# EAGLE design ArduSatPrototypingModule (EAGLE 6.3)
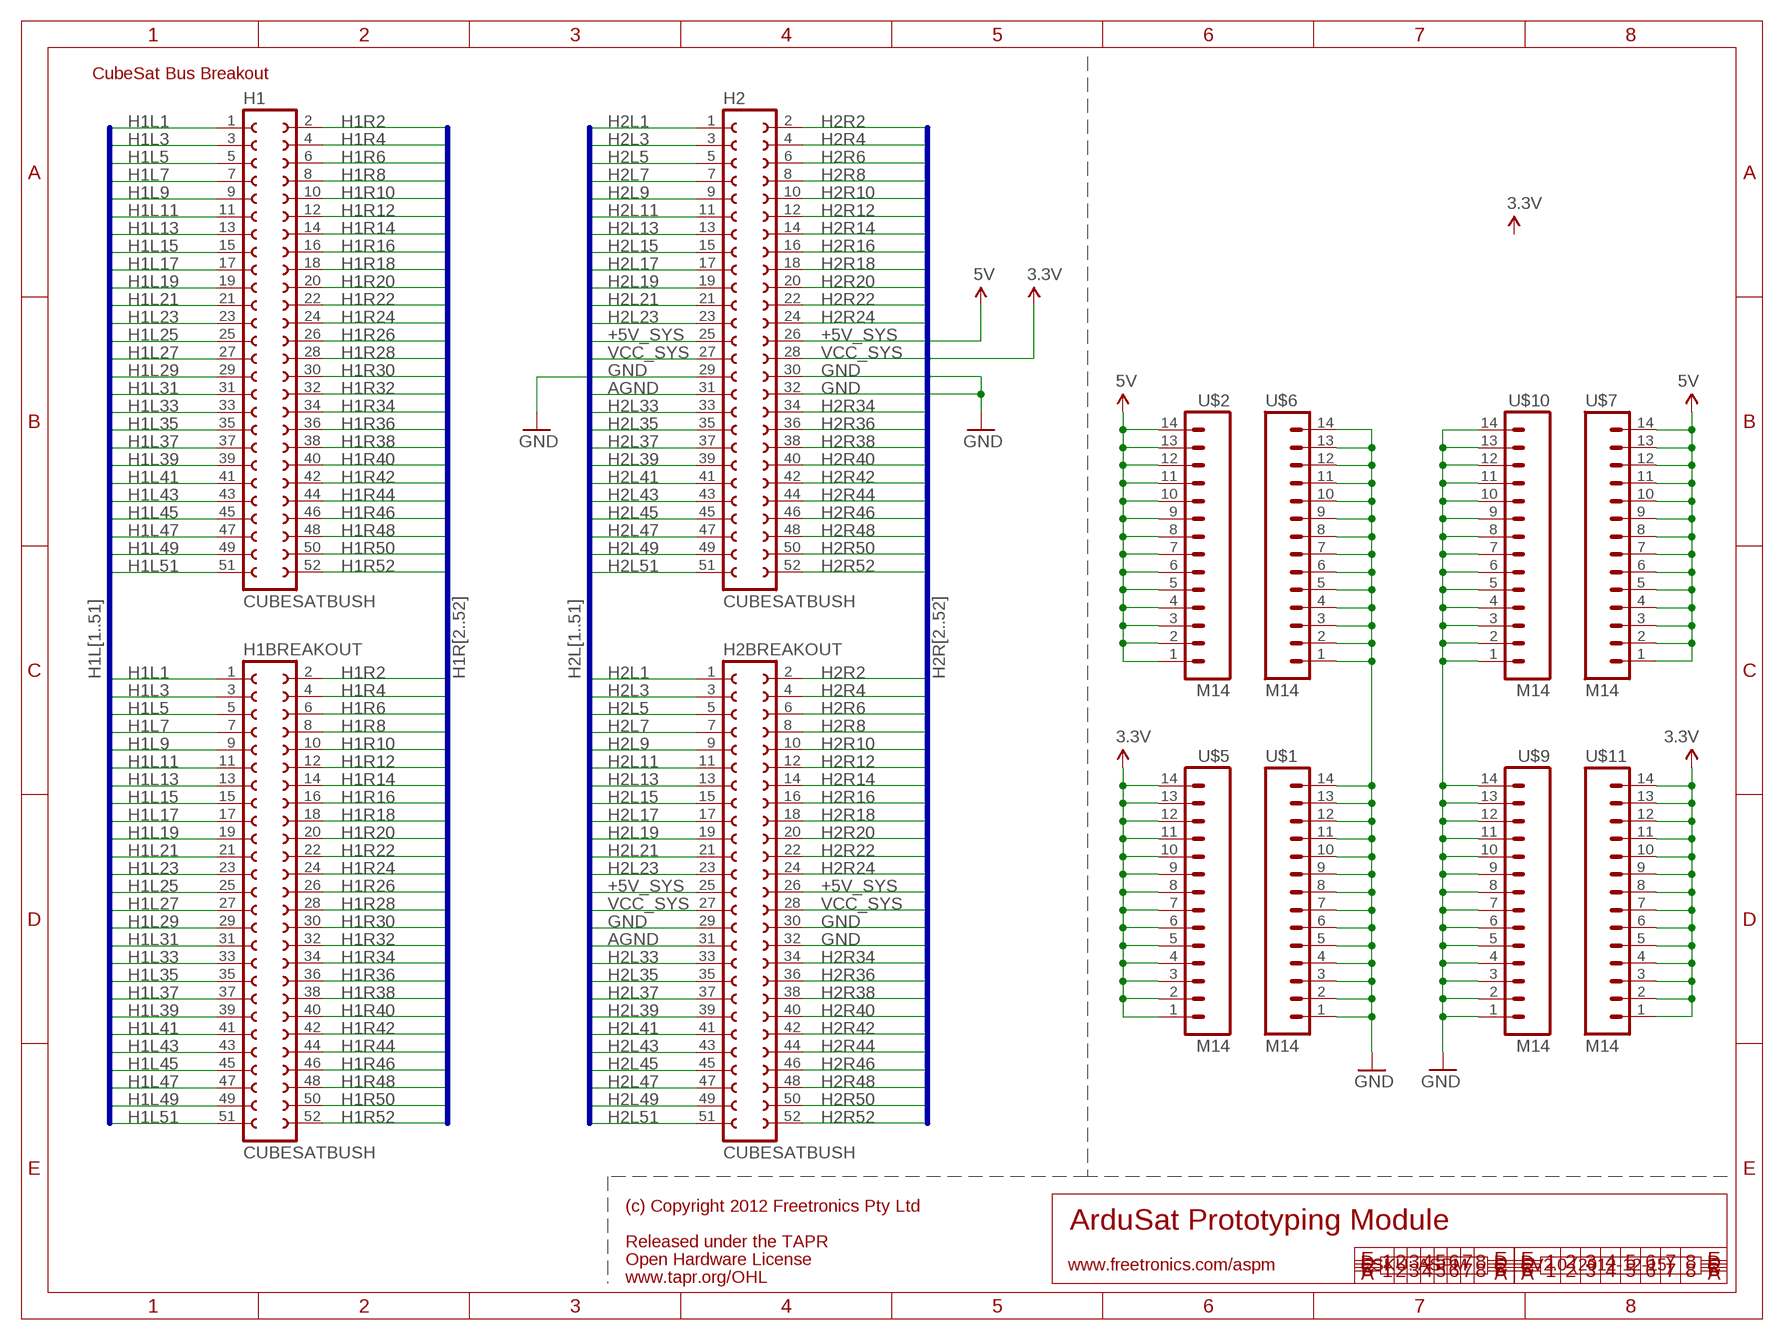
[diagram p0: schematic, sheet 1]

## Parts
H1  CUBESATBUSH  [CUBESATBUS]
H1BREAKOUT  CUBESATBUSH  [CUBESATBUS]
H2  CUBESATBUSH  [CUBESATBUS]
H2BREAKOUT  CUBESATBUSH  [CUBESATBUS]
U$1  M14  [1X14]
U$2  M14  [1X14]
U$5  M14  [1X14]
U$6  M14  [1X14]
U$7  M14  [1X14]
U$9  M14  [1X14]
U$10  M14  [1X14]
U$11  M14  [1X14]

## Nets
+5V_SYS: H2.25 H2.26 H2BREAKOUT.25 H2BREAKOUT.26 U$2.1 U$2.2 U$2.3 U$2.4 U$2.5 U$2.6 U$2.7 U$2.8 U$2.9 U$2.10 U$2.11 U$2.12 U$2.13 U$2.14 U$7.1 U$7.2 U$7.3 U$7.4 U$7.5 U$7.6 U$7.7 U$7.8 U$7.9 U$7.10 U$7.11 U$7.12 U$7.13 U$7.14 ; supply symbol labelled 5V
AGND: H2.31 H2BREAKOUT.31
GND: H2.29 H2.30 H2.32 H2BREAKOUT.29 H2BREAKOUT.30 H2BREAKOUT.32 U$1.1 U$1.2 U$1.3 U$1.4 U$1.5 U$1.6 U$1.7 U$1.8 U$1.9 U$1.10 U$1.11 U$1.12 U$1.13 U$1.14 U$6.1 U$6.2 U$6.3 U$6.4 U$6.5 U$6.6 U$6.7 U$6.8 U$6.9 U$6.10 U$6.11 U$6.12 U$6.13 U$6.14 U$9.1 U$9.2 U$9.3 U$9.4 U$9.5 U$9.6 U$9.7 U$9.8 U$9.9 U$9.10 U$9.11 U$9.12 U$9.13 U$9.14 U$10.1 U$10.2 U$10.3 U$10.4 U$10.5 U$10.6 U$10.7 U$10.8 U$10.9 U$10.10 U$10.11 U$10.12 U$10.13 U$10.14
H1L1: H1.1 H1BREAKOUT.1
H1L3: H1.3 H1BREAKOUT.3
H1L5: H1.5 H1BREAKOUT.5
H1L7: H1.7 H1BREAKOUT.7
H1L9: H1.9 H1BREAKOUT.9
H1L11: H1.11 H1BREAKOUT.11
H1L13: H1.13 H1BREAKOUT.13
H1L15: H1.15 H1BREAKOUT.15
H1L17: H1.17 H1BREAKOUT.17
H1L19: H1.19 H1BREAKOUT.19
H1L21: H1.21 H1BREAKOUT.21
H1L23: H1.23 H1BREAKOUT.23
H1L25: H1.25 H1BREAKOUT.25
H1L27: H1.27 H1BREAKOUT.27
H1L29: H1.29 H1BREAKOUT.29
H1L31: H1.31 H1BREAKOUT.31
H1L33: H1.33 H1BREAKOUT.33
H1L35: H1.35 H1BREAKOUT.35
H1L37: H1.37 H1BREAKOUT.37
H1L39: H1.39 H1BREAKOUT.39
H1L41: H1.41 H1BREAKOUT.41
H1L43: H1.43 H1BREAKOUT.43
H1L45: H1.45 H1BREAKOUT.45
H1L47: H1.47 H1BREAKOUT.47
H1L49: H1.49 H1BREAKOUT.49
H1L51: H1.51 H1BREAKOUT.51
H1R2: H1.2 H1BREAKOUT.2
H1R4: H1.4 H1BREAKOUT.4
H1R6: H1.6 H1BREAKOUT.6
H1R8: H1.8 H1BREAKOUT.8
H1R10: H1.10 H1BREAKOUT.10
H1R12: H1.12 H1BREAKOUT.12
H1R14: H1.14 H1BREAKOUT.14
H1R16: H1.16 H1BREAKOUT.16
H1R18: H1.18 H1BREAKOUT.18
H1R20: H1.20 H1BREAKOUT.20
H1R22: H1.22 H1BREAKOUT.22
H1R24: H1.24 H1BREAKOUT.24
H1R26: H1.26 H1BREAKOUT.26
H1R28: H1.28 H1BREAKOUT.28
H1R30: H1.30 H1BREAKOUT.30
H1R32: H1.32 H1BREAKOUT.32
H1R34: H1.34 H1BREAKOUT.34
H1R36: H1.36 H1BREAKOUT.36
H1R38: H1.38 H1BREAKOUT.38
H1R40: H1.40 H1BREAKOUT.40
H1R42: H1.42 H1BREAKOUT.42
H1R44: H1.44 H1BREAKOUT.44
H1R46: H1.46 H1BREAKOUT.46
H1R48: H1.48 H1BREAKOUT.48
H1R50: H1.50 H1BREAKOUT.50
H1R52: H1.52 H1BREAKOUT.52
H2L1: H2.1 H2BREAKOUT.1
H2L3: H2.3 H2BREAKOUT.3
H2L5: H2.5 H2BREAKOUT.5
H2L7: H2.7 H2BREAKOUT.7
H2L9: H2.9 H2BREAKOUT.9
H2L11: H2.11 H2BREAKOUT.11
H2L13: H2.13 H2BREAKOUT.13
H2L15: H2.15 H2BREAKOUT.15
H2L17: H2.17 H2BREAKOUT.17
H2L19: H2.19 H2BREAKOUT.19
H2L21: H2.21 H2BREAKOUT.21
H2L23: H2.23 H2BREAKOUT.23
H2L33: H2.33 H2BREAKOUT.33
H2L35: H2.35 H2BREAKOUT.35
H2L37: H2.37 H2BREAKOUT.37
H2L39: H2.39 H2BREAKOUT.39
H2L41: H2.41 H2BREAKOUT.41
H2L43: H2.43 H2BREAKOUT.43
H2L45: H2.45 H2BREAKOUT.45
H2L47: H2.47 H2BREAKOUT.47
H2L49: H2.49 H2BREAKOUT.49
H2L51: H2.51 H2BREAKOUT.51
H2R2: H2.2 H2BREAKOUT.2
H2R4: H2.4 H2BREAKOUT.4
H2R6: H2.6 H2BREAKOUT.6
H2R8: H2.8 H2BREAKOUT.8
H2R10: H2.10 H2BREAKOUT.10
H2R12: H2.12 H2BREAKOUT.12
H2R14: H2.14 H2BREAKOUT.14
H2R16: H2.16 H2BREAKOUT.16
H2R18: H2.18 H2BREAKOUT.18
H2R20: H2.20 H2BREAKOUT.20
H2R22: H2.22 H2BREAKOUT.22
H2R24: H2.24 H2BREAKOUT.24
H2R34: H2.34 H2BREAKOUT.34
H2R36: H2.36 H2BREAKOUT.36
H2R38: H2.38 H2BREAKOUT.38
H2R40: H2.40 H2BREAKOUT.40
H2R42: H2.42 H2BREAKOUT.42
H2R44: H2.44 H2BREAKOUT.44
H2R46: H2.46 H2BREAKOUT.46
H2R48: H2.48 H2BREAKOUT.48
H2R50: H2.50 H2BREAKOUT.50
H2R52: H2.52 H2BREAKOUT.52
VCC_SYS: H2.27 H2.28 H2BREAKOUT.27 H2BREAKOUT.28 U$5.1 U$5.2 U$5.3 U$5.4 U$5.5 U$5.6 U$5.7 U$5.8 U$5.9 U$5.10 U$5.11 U$5.12 U$5.13 U$5.14 U$11.1 U$11.2 U$11.3 U$11.4 U$11.5 U$11.6 U$11.7 U$11.8 U$11.9 U$11.10 U$11.11 U$11.12 U$11.13 U$11.14 ; supply symbol labelled 3.3V

## Buses
H1L[1..51]
H1R[2..52]
H2L[1..51]
H2R[2..52]

## Notes on the sheet
- CubeSat Bus Breakout
- (c) Copyright 2012 Freetronics Pty Ltd
- ArduSat Prototyping Module
- Released under the TAPR
- Open Hardware License
- www.freetronics.com/aspm | SKU: ASPM | V2.0 (2012-12-15)
- www.tapr.org/OHL

## Library data of the parts
H1 H1BREAKOUT H2 H2BREAKOUT = freetronics-jon:CUBESATBUS
U$1 U$2 U$5-U$7 U$9-U$11 = freetronics-original:M14: Header 14 Standard 14-pin 0.1" header. Use with straight break away headers (SKU : PRT-00116), right angle break away headers (PRT-00553), swiss pins (PRT-00743), machine pins (PRT-00117), and female headers (PRT-00115).

## Board
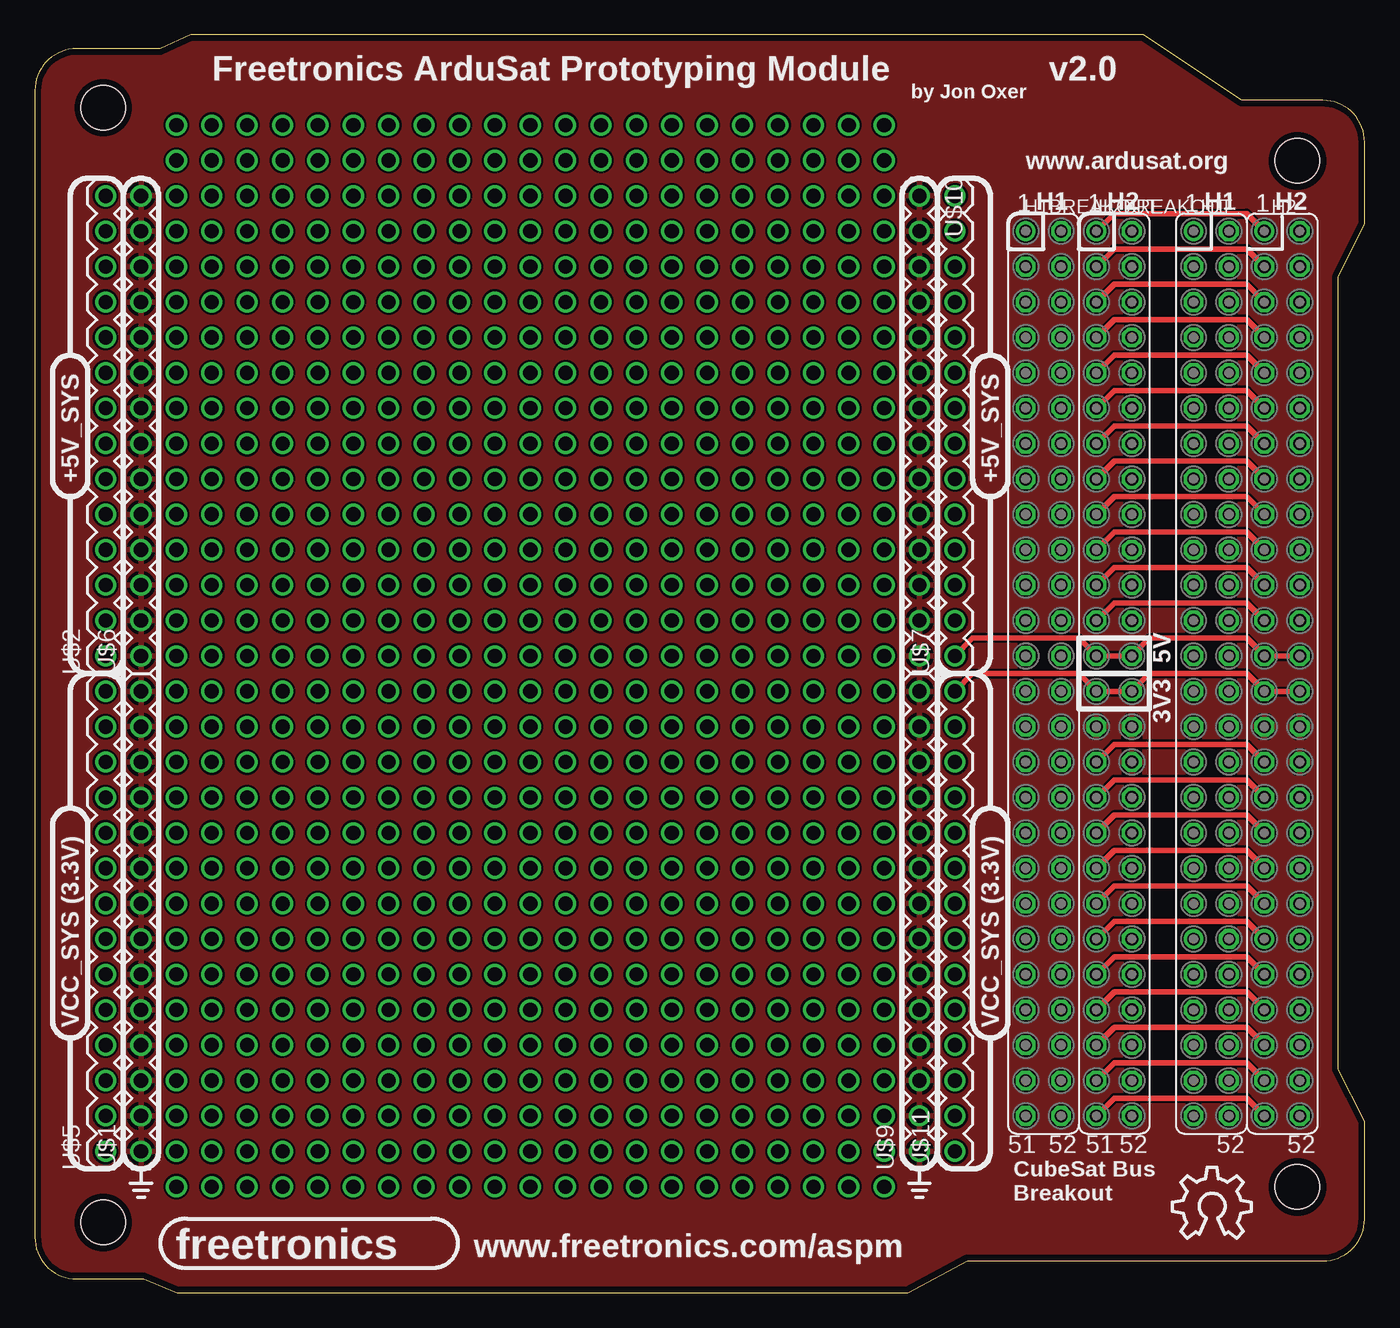
[diagram p1: board, top side]
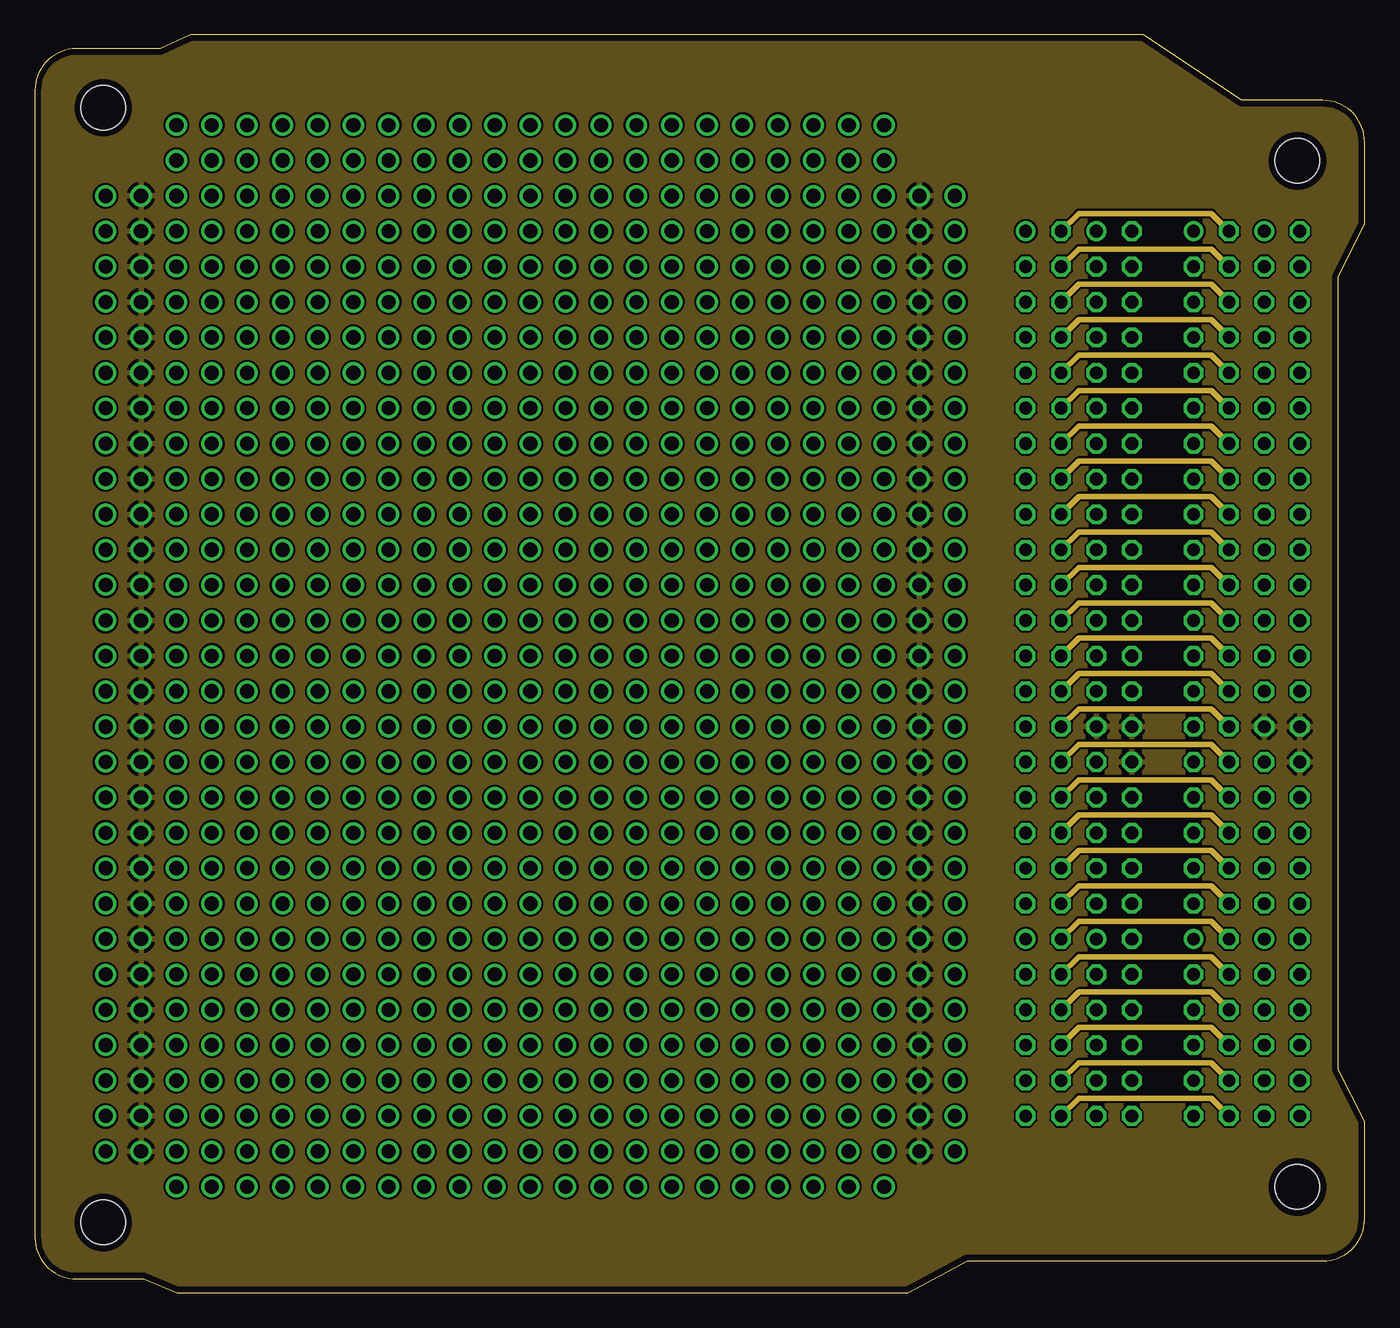
[diagram p2: board, inner layer Route2]
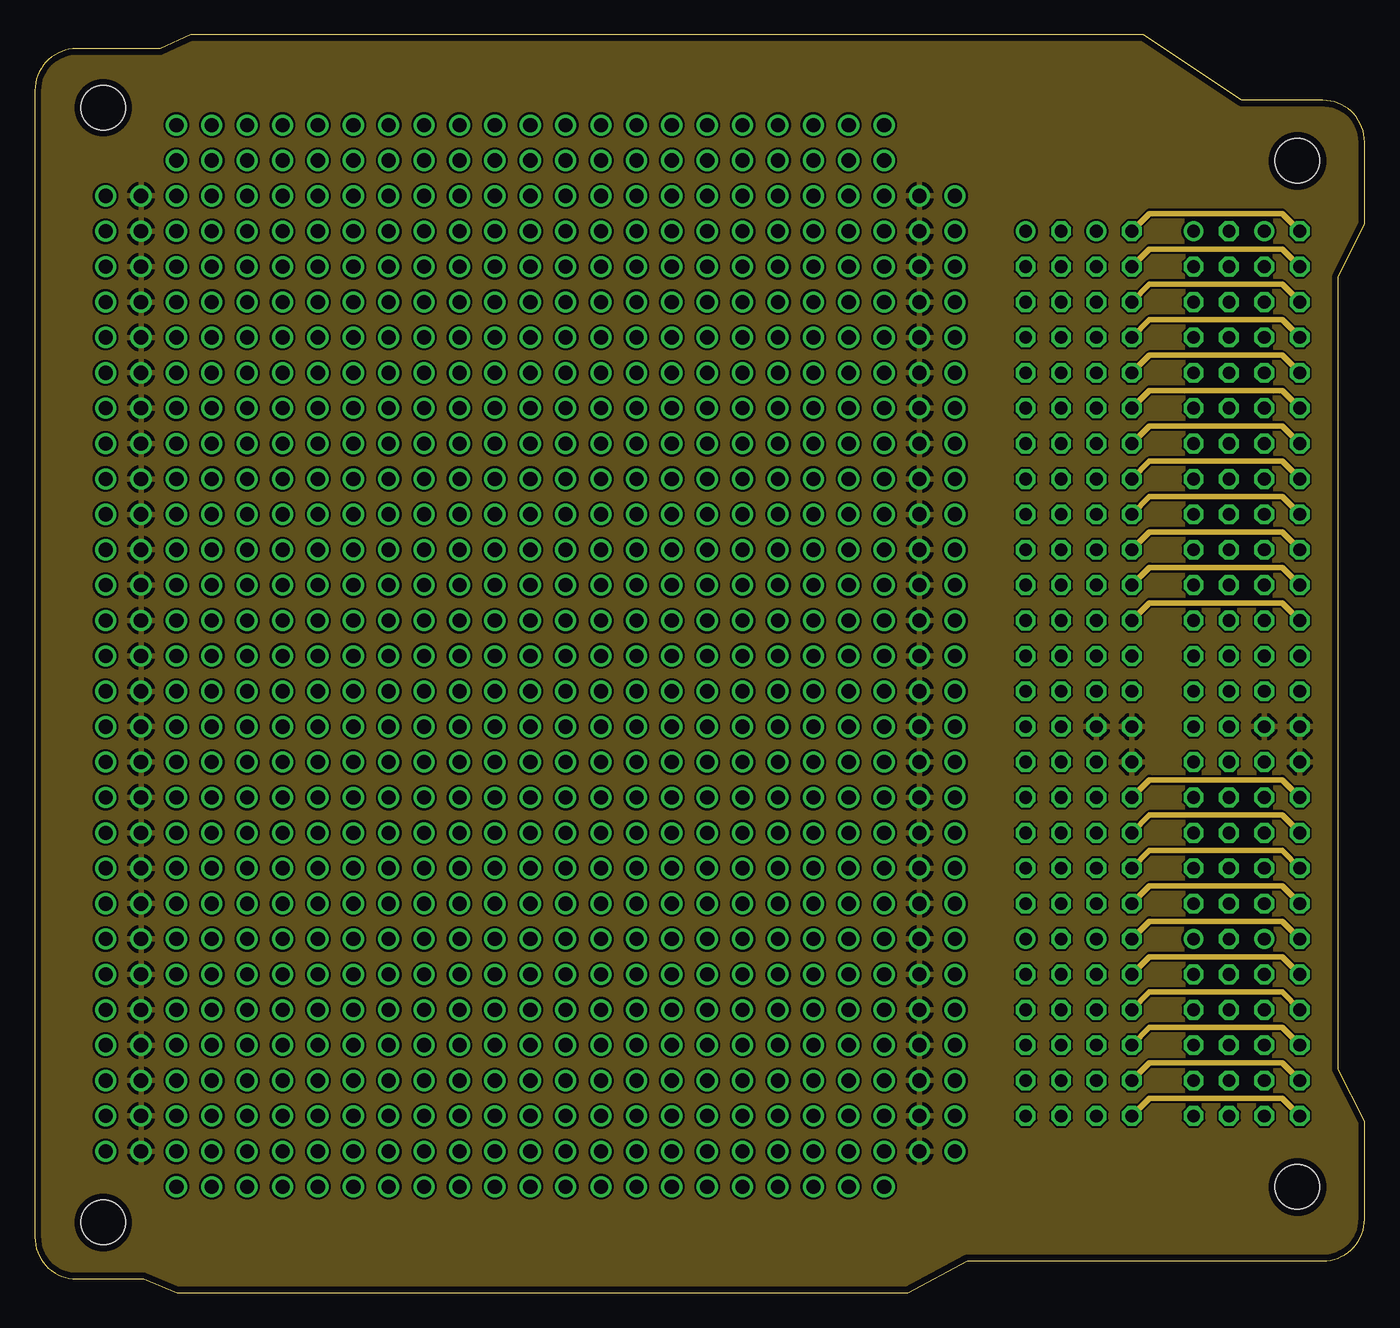
[diagram p3: board, inner layer Route15]
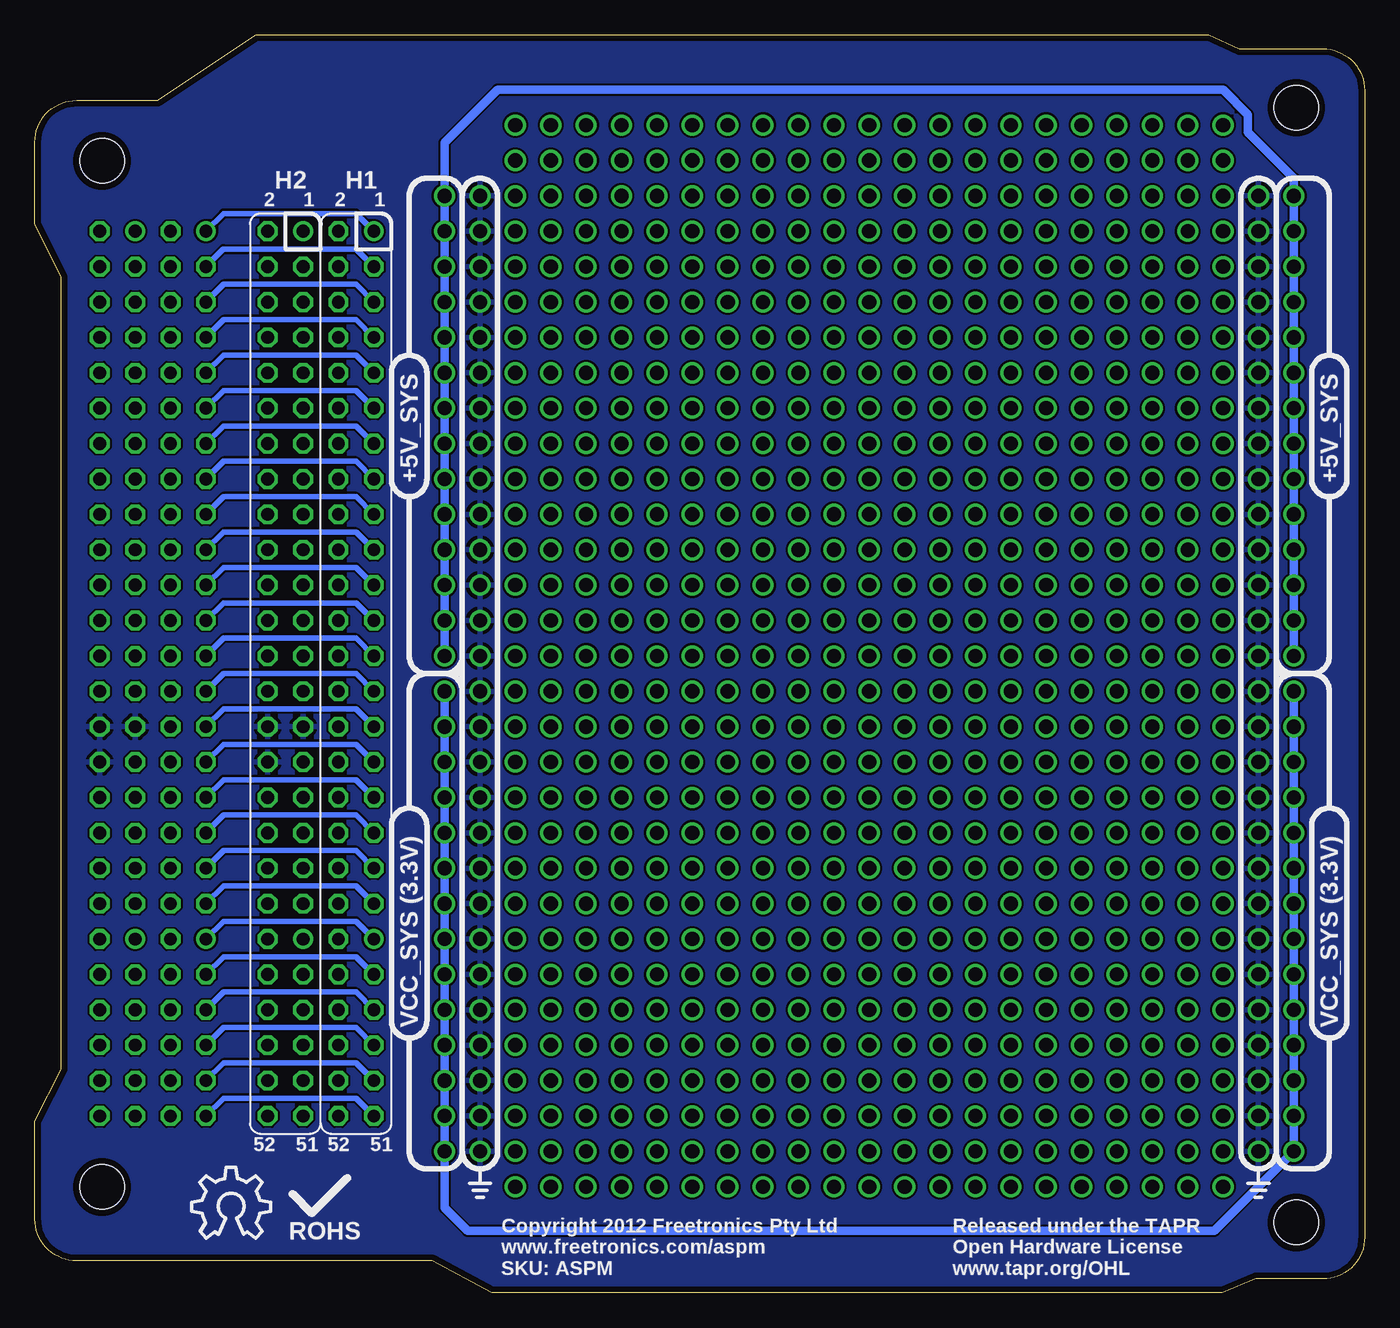
[diagram p4: board, bottom side, seen from below]

Size 95.45 x 90.3 mm. Coordinates in mm from the lower left corner, seen from the top.
Outline: 0,4 arc90 3,1 7.81,1 10.23,0 62.65,0 66.94,2.3 92.45,2.3 arc90 95.45,5.3 95.45,12.31 93.55,16.05 93.55,72.91 95.45,76.74 95.45,82.6 arc90 92.45,85.6 86.64,85.6 79.56,90.3 11.2,90.3 9,89.3 3,89.3 arc90 0,86.3 0,4
Copper layers (1+2*15+16): Top 0.035mm / dielectric 1.5mm / Route2 0.035mm / dielectric 0.15mm / Route15 0.035mm / dielectric 0.2mm / Bottom 0.035mm
Design rules "default *": minimum track width 6mil, minimum drill 24mil, track to track 6mil, track to pad 12mil, pad to pad 12mil, via to via 12mil, smd to smd 8mil, copper to edge 18mil, drill to drill 8mil, minimum pad ring 10mil, minimum via ring 8mil, stop-mask expansion 4mil, vias tented up to drill 0mil, thermal gap 10mil
Holes 3.2 mm at 4.91,5.05 4.91,85.07 90.63,81.26 90.63,7.6

### Footprints (pad centres in the part's own frame; a part is rotated, then mirrored left to right if it is on the bottom)
CUBESATBUS = drill 0.914: 1 -31.75,-1.27; 41 19.05,-1.27 | drill 0.914 octagon: 2 -31.75,1.27; 3 -29.21,-1.27; 4 -29.21,1.27; 5 -26.67,-1.27; 6 -26.67,1.27; 7 -24.13,-1.27; 8 -24.13,1.27; 9 -21.59,-1.27; 10 -21.59,1.27; 11 -19.05,-1.27; 12 -19.05,1.27; 13 -16.51,-1.27; 14 -16.51,1.27; 15 -13.97,-1.27; 16 -13.97,1.27; 17 -11.43,-1.27; 18 -11.43,1.27; 19 -8.89,-1.27; 20 -8.89,1.27; 21 -6.35,-1.27; 22 -6.35,1.27; 23 -3.81,-1.27; 24 -3.81,1.27; 25 -1.27,-1.27; 26 -1.27,1.27; 27 1.27,-1.27; 28 1.27,1.27; 29 3.81,-1.27; 30 3.81,1.27; 31 6.35,-1.27; 32 6.35,1.27; 33 8.89,-1.27; 34 8.89,1.27; 35 11.43,-1.27; 36 11.43,1.27; 37 13.97,-1.27; 38 13.97,1.27; 39 16.51,-1.27; 40 16.51,1.27; 42 19.05,1.27; 43 21.59,-1.27; 44 21.59,1.27; 45 24.13,-1.27; 46 24.13,1.27; 47 26.67,-1.27; 48 26.67,1.27; 49 29.21,-1.27; 50 29.21,1.27; 51 31.75,-1.27; 52 31.75,1.27
1X14 = drill 1.016: 1 0,0; 2 2.54,0; 3 5.08,0; 4 7.62,0; 5 10.16,0; 6 12.7,0; 7 15.24,0; 8 17.78,0; 9 20.32,0; 10 22.86,0; 11 25.4,0; 12 27.94,0; 13 30.48,0; 14 33.02,0

### Placement (x,y rotation side)
H1  84.44,44.45 270 top
H1BREAKOUT  72.39,44.45 270 top
H2  89.52,44.45 270 top
H2BREAKOUT  77.47,44.45 270 top
U$1  7.62,10.16 90 top
U$2  5.08,45.72 90 top
U$5  5.08,10.16 90 top
U$6  7.62,45.72 90 top
U$7  66.04,45.72 90 top
U$9  63.5,10.16 90 top
U$10  63.5,78.74 270 top
U$11  66.04,10.16 90 top
U$12  [OSHW_10X200_NOTEXT]  84.2,3.94 0 bottom
U$13  [OSHW_10X200_NOTEXT]  81.66,3.94 0 top

### Tracks (layer width: path | path; a pad name or v marks a point on that pad's centre or on a via)
+5V_SYS
  Top 0.406: U$7.1 67.31,46.99 74.93,46.99 H2BREAKOUT.25 H2BREAKOUT.26 80.01,46.99 87,46.99 88.25,45.73 H2.25 H2.26
  Bottom 0.254: U$7.1 66.04,75.56
  Bottom 0.61: U$2.1 U$2.2 U$2.3 U$2.4 U$2.5 U$2.6 U$2.7 U$2.8 U$2.9 U$2.10 U$2.11 U$2.12 U$2.13 U$2.14 5.08,80.01 8.38,83.31 8.38,84.58 10.16,86.36 62.23,86.36 66.04,82.55 U$7.14 U$7.13 U$7.12 U$7.11 U$7.10 U$7.9 U$7.8 U$7.7 U$7.6 U$7.5 U$7.4 U$7.3 U$7.2 U$7.1
AGND
  Top 0.406: H2.31 88.25,38.12 87,39.37 77.47,39.37 H2BREAKOUT.31
GND
  pour Bottom: 0,86.3 arc-90 3,89.3 9,89.3 11.2,90.3 79.56,90.3 86.64,85.6 92.45,85.6 arc-90 95.45,82.6 95.45,76.74 93.55,72.91 93.55,16.05 95.45,12.31 95.45,5.08 arc-90 92.45,2.3 66.94,2.3 62.65,0 10.16,0 7.81,1 3,1 arc-90 0,4
  pour Top: 0,86.3 arc-90 3,89.3 9,89.3 11.2,90.3 79.56,90.3 86.64,85.6 92.45,85.6 arc-90 95.45,82.6 95.45,76.74 93.55,72.91 93.55,16.05 95.45,12.31 95.45,5.08 arc-90 92.45,2.3 66.94,2.3 62.65,0 10.16,0 7.81,1 3,1 arc-90 0,4
  pour Route2: 0,86.3 arc-90 3,89.3 9,89.3 11.2,90.3 79.56,90.3 86.64,85.6 92.45,85.6 arc-90 95.45,82.6 95.45,76.74 93.55,72.91 93.55,16.05 95.45,12.31 95.45,5.08 arc-90 92.45,2.3 66.94,2.3 62.65,0 10.16,0 7.81,1 3,1 arc-90 0,4
  pour Route15: 0,86.3 arc-90 3,89.3 9,89.3 11.2,90.3 79.56,90.3 86.64,85.6 92.45,85.6 arc-90 95.45,82.6 95.45,76.74 93.55,72.91 93.55,16.05 95.45,12.31 95.45,5.08 arc-90 92.45,2.3 66.94,2.3 62.65,0 10.16,0 7.81,1 3,1 arc-90 0,4
H1L1
  Bottom 0.406: H1BREAKOUT.1 72.39,77.47 81.9,77.47 H1.1
H1L3
  Bottom 0.406: H1.3 83.17,73.67 81.92,74.93 72.39,74.93 H1BREAKOUT.3
H1L5
  Bottom 0.406: H1BREAKOUT.5 72.39,72.39 81.9,72.39 H1.5
H1L7
  Bottom 0.406: H1BREAKOUT.7 72.39,69.85 81.9,69.85 H1.7
H1L9
  Bottom 0.406: H1BREAKOUT.9 72.39,67.31 81.9,67.31 H1.9
H1L11
  Bottom 0.406: H1BREAKOUT.11 72.39,64.77 81.9,64.77 H1.11
H1L13
  Bottom 0.406: H1BREAKOUT.13 72.39,62.23 81.9,62.23 H1.13
H1L15
  Bottom 0.406: H1BREAKOUT.15 72.39,59.69 81.9,59.69 H1.15
H1L17
  Bottom 0.406: H1BREAKOUT.17 72.39,57.15 81.9,57.15 H1.17
H1L19
  Bottom 0.406: H1BREAKOUT.19 72.39,54.61 81.9,54.61 H1.19
H1L21
  Bottom 0.406: H1BREAKOUT.21 72.39,52.07 81.9,52.07 H1.21
H1L23
  Bottom 0.406: H1BREAKOUT.23 72.39,49.53 81.9,49.53 H1.23
H1L25
  Bottom 0.406: H1BREAKOUT.25 72.39,46.99 81.9,46.99 H1.25
H1L27
  Bottom 0.406: H1BREAKOUT.27 72.39,44.45 81.9,44.45 H1.27
H1L29
  Bottom 0.406: H1BREAKOUT.29 72.39,41.91 81.9,41.91 H1.29
H1L31
  Bottom 0.406: H1BREAKOUT.31 72.39,39.37 81.9,39.37 H1.31
H1L33
  Bottom 0.406: H1BREAKOUT.33 72.39,36.83 81.9,36.83 H1.33
H1L35
  Bottom 0.406: H1BREAKOUT.35 72.39,34.29 81.9,34.29 H1.35
H1L37
  Bottom 0.406: H1BREAKOUT.37 72.39,31.75 81.9,31.75 H1.37
H1L39
  Bottom 0.406: H1BREAKOUT.39 72.39,29.21 81.9,29.21 H1.39
H1L41
  Bottom 0.406: H1BREAKOUT.41 72.39,26.67 81.9,26.67 H1.41
H1L43
  Bottom 0.406: H1BREAKOUT.43 72.39,24.13 81.9,24.13 H1.43
H1L45
  Bottom 0.406: H1BREAKOUT.45 72.39,21.59 81.9,21.59 H1.45
H1L47
  Bottom 0.406: H1BREAKOUT.47 72.39,19.05 81.9,19.05 H1.47
H1L49
  Bottom 0.406: H1BREAKOUT.49 72.39,16.51 81.9,16.51 H1.49
H1L51
  Bottom 0.406: H1BREAKOUT.51 72.39,13.97 81.9,13.97 H1.51
H1R2
  Route2 0.406: H1.2 85.71,76.22 84.45,77.47 74.93,77.47 H1BREAKOUT.2
H1R4
  Route2 0.406: H1.4 85.71,73.67 84.45,74.93 74.93,74.93 H1BREAKOUT.4
H1R6
  Route2 0.406: H1.6 85.71,71.14 84.45,72.39 74.93,72.39 H1BREAKOUT.6
H1R8
  Route2 0.406: H1.8 85.71,68.59 84.45,69.85 74.93,69.85 H1BREAKOUT.8
H1R10
  Route2 0.406: H1BREAKOUT.10 74.93,67.31 84.44,67.31 H1.10
H1R12
  Route2 0.406: H1.12 85.71,63.52 84.45,64.77 74.93,64.77 H1BREAKOUT.12
H1R14
  Route2 0.406: H1BREAKOUT.14 74.93,62.23 84.44,62.23 H1.14
H1R16
  Route2 0.406: H1.16 85.71,58.44 84.45,59.69 74.93,59.69 H1BREAKOUT.16
H1R18
  Route2 0.406: H1.18 85.71,55.9 84.45,57.15 74.93,57.15 H1BREAKOUT.18
H1R20
  Route2 0.406: H1BREAKOUT.20 74.93,54.61 84.44,54.61 H1.20
H1R22
  Route2 0.406: H1.22 85.71,50.81 84.45,52.07 74.93,52.07 H1BREAKOUT.22
H1R24
  Route2 0.406: H1.24 85.71,48.27 84.45,49.53 74.93,49.53 H1BREAKOUT.24
H1R26
  Route2 0.406: H1.26 85.71,45.73 84.45,46.99 74.93,46.99 H1BREAKOUT.26
H1R28
  Route2 0.406: H1.28 85.71,43.2 84.45,44.45 74.93,44.45 H1BREAKOUT.28
H1R30
  Route2 0.406: H1.30 85.71,40.66 84.45,41.91 74.93,41.91 H1BREAKOUT.30
H1R32
  Route2 0.406: H1.32 85.71,38.12 84.45,39.37 74.93,39.37 H1BREAKOUT.32
H1R34
  Route2 0.406: H1.34 85.71,35.58 84.45,36.83 74.93,36.83 H1BREAKOUT.34
H1R36
  Route2 0.406: H1.36 85.71,33.03 84.45,34.29 74.93,34.29 H1BREAKOUT.36
H1R38
  Route2 0.406: H1.38 85.71,30.5 84.45,31.75 74.93,31.75 H1BREAKOUT.38
H1R40
  Route2 0.406: H1.40 85.71,27.95 84.45,29.21 74.93,29.21 H1BREAKOUT.40
H1R42
  Route2 0.406: H1.42 85.71,25.41 84.45,26.67 74.93,26.67 H1BREAKOUT.42
H1R44
  Route2 0.406: H1.44 85.71,22.88 84.45,24.13 74.93,24.13 H1BREAKOUT.44
H1R46
  Route2 0.406: H1.46 85.71,20.34 84.45,21.59 74.93,21.59 H1BREAKOUT.46
H1R48
  Route2 0.406: H1.48 85.71,17.8 84.45,19.05 74.93,19.05 H1BREAKOUT.48
H1R50
  Route2 0.406: H1.50 85.71,15.26 84.45,16.51 74.93,16.51 H1BREAKOUT.50
H1R52
  Route2 0.406: H1.52 85.71,12.71 84.45,13.97 74.93,13.97 H1BREAKOUT.52
H2L1
  Top 0.406: H2BREAKOUT.1 77.47,77.47 86.98,77.47 H2.1
H2L3
  Top 0.406: H2.3 88.25,73.67 87,74.93 77.47,74.93 H2BREAKOUT.3
H2L5
  Top 0.406: H2BREAKOUT.5 77.47,72.39 86.98,72.39 H2.5
H2L7
  Top 0.406: H2.7 88.25,68.59 87,69.85 77.47,69.85 H2BREAKOUT.7
H2L9
  Top 0.406: H2BREAKOUT.9 77.47,67.31 86.98,67.31 H2.9
H2L11
  Top 0.406: H2.11 88.25,63.52 87,64.77 77.47,64.77 H2BREAKOUT.11
H2L13
  Top 0.406: H2BREAKOUT.13 77.47,62.23 86.98,62.23 H2.13
H2L15
  Top 0.406: H2.15 88.25,58.44 87,59.69 77.47,59.69 H2BREAKOUT.15
H2L17
  Top 0.406: H2BREAKOUT.17 77.47,57.15 86.98,57.15 H2.17
H2L19
  Top 0.406: H2.19 88.25,53.35 87,54.61 77.47,54.61 H2BREAKOUT.19
H2L21
  Top 0.406: H2.21 88.25,50.81 87,52.07 77.47,52.07 H2BREAKOUT.21
H2L23
  Top 0.406: H2.23 88.25,48.27 87,49.53 77.47,49.53 H2BREAKOUT.23
H2L33
  Top 0.406: H2.33 88.25,35.58 87,36.83 77.47,36.83 H2BREAKOUT.33
H2L35
  Top 0.406: H2.35 88.25,33.03 87,34.29 77.47,34.29 H2BREAKOUT.35
H2L37
  Top 0.406: H2.37 88.25,30.5 87,31.75 77.47,31.75 H2BREAKOUT.37
H2L39
  Top 0.406: H2.39 88.25,27.95 87,29.21 77.47,29.21 H2BREAKOUT.39
H2L41
  Top 0.406: H2.41 88.25,25.41 87,26.67 77.47,26.67 H2BREAKOUT.41
H2L43
  Top 0.406: H2.43 88.25,22.88 87,24.13 77.47,24.13 H2BREAKOUT.43
H2L45
  Top 0.406: H2.45 88.25,20.34 87,21.59 77.47,21.59 H2BREAKOUT.45
H2L47
  Top 0.406: H2.47 88.25,17.8 87,19.05 77.47,19.05 H2BREAKOUT.47
H2L49
  Top 0.406: H2.49 88.25,15.26 87,16.51 77.47,16.51 H2BREAKOUT.49
H2L51
  Top 0.406: H2.51 88.25,12.71 87,13.97 77.47,13.97 H2BREAKOUT.51
H2R2
  Route15 0.406: H2.2 90.79,76.22 89.53,77.47 80.01,77.47 H2BREAKOUT.2
H2R4
  Route15 0.406: H2.4 90.79,73.67 89.53,74.93 80.01,74.93 H2BREAKOUT.4
H2R6
  Route15 0.406: H2.6 90.79,71.14 89.53,72.39 80.01,72.39 H2BREAKOUT.6
H2R8
  Route15 0.406: H2.8 90.79,68.59 89.53,69.85 80.01,69.85 H2BREAKOUT.8
H2R10
  Route15 0.406: H2.10 90.79,66.06 89.53,67.31 80.01,67.31 H2BREAKOUT.10
H2R12
  Route15 0.406: H2.12 90.79,63.52 89.53,64.77 80.01,64.77 H2BREAKOUT.12
H2R14
  Route15 0.406: H2.14 90.79,60.98 89.53,62.23 80.01,62.23 H2BREAKOUT.14
H2R16
  Route15 0.406: H2.16 90.79,58.44 89.53,59.69 80.01,59.69 H2BREAKOUT.16
H2R18
  Route15 0.406: H2.18 90.79,55.9 89.53,57.15 80.01,57.15 H2BREAKOUT.18
H2R20
  Route15 0.406: H2.20 90.79,53.35 89.53,54.61 80.01,54.61 H2BREAKOUT.20
H2R22
  Route15 0.406: H2BREAKOUT.22 80.01,52.07 89.52,52.07 H2.22
H2R24
  Route15 0.406: H2.24 90.79,48.27 89.53,49.53 80.01,49.53 H2BREAKOUT.24
H2R34
  Route15 0.406: H2BREAKOUT.34 80.01,36.83 89.52,36.83 H2.34
H2R36
  Route15 0.406: H2.36 90.79,33.03 89.53,34.29 80.01,34.29 H2BREAKOUT.36
H2R38
  Route15 0.406: H2BREAKOUT.38 80.01,31.75 89.52,31.75 H2.38
H2R40
  Route15 0.406: H2.40 90.79,27.95 89.53,29.21 80.01,29.21 H2BREAKOUT.40
H2R42
  Route15 0.406: H2BREAKOUT.42 80.01,26.67 89.52,26.67 H2.42
H2R44
  Route15 0.406: H2.44 90.79,22.88 89.53,24.13 80.01,24.13 H2BREAKOUT.44
H2R46
  Route15 0.406: H2BREAKOUT.46 80.01,21.59 89.52,21.59 H2.46
H2R48
  Route15 0.406: H2.48 90.79,17.8 89.53,19.05 80.01,19.05 H2BREAKOUT.48
H2R50
  Route15 0.406: H2BREAKOUT.50 80.01,16.51 89.52,16.51 H2.50
H2R52
  Route15 0.406: H2.52 90.79,12.71 89.53,13.97 80.01,13.97 H2BREAKOUT.52
N$2  (via drill 1.02)
  other vias: 60.96,45.72
N$3  (via drill 1.02)
  other vias: 58.42,45.72
N$4  (via drill 1.02)
  other vias: 55.88,45.72
N$5  (via drill 1.02)
  other vias: 58.42,55.88
N$7  (via drill 1.02)
  other vias: 55.88,55.88
N$8  (via drill 1.02)
  other vias: 53.34,55.88
N$9  (via drill 1.02)
  other vias: 50.8,55.88
N$10  (via drill 1.02)
  other vias: 48.26,55.88
N$11  (via drill 1.02)
  other vias: 45.72,55.88
N$12  (via drill 1.02)
  other vias: 43.18,55.88
N$13  (via drill 1.02)
  other vias: 40.64,55.88
N$14  (via drill 1.02)
  other vias: 38.1,55.88
N$15  (via drill 1.02)
  other vias: 35.56,55.88
N$16  (via drill 1.02)
  other vias: 33.02,55.88
N$17  (via drill 1.02)
  other vias: 30.48,55.88
N$18  (via drill 1.02)
  other vias: 27.94,55.88
N$19  (via drill 1.02)
  other vias: 25.4,55.88
N$20  (via drill 1.02)
  other vias: 22.86,55.88
N$21  (via drill 1.02)
  other vias: 20.32,55.88
N$22  (via drill 1.02)
  other vias: 58.42,53.34
N$23  (via drill 1.02)
  other vias: 55.88,53.34
N$24  (via drill 1.02)
  other vias: 53.34,53.34
N$25  (via drill 1.02)
  other vias: 50.8,53.34
N$26  (via drill 1.02)
  other vias: 48.26,53.34
N$27  (via drill 1.02)
  other vias: 45.72,53.34
N$28  (via drill 1.02)
  other vias: 43.18,53.34
N$29  (via drill 1.02)
  other vias: 40.64,53.34
N$30  (via drill 1.02)
  other vias: 38.1,53.34
N$31  (via drill 1.02)
  other vias: 35.56,53.34
N$32  (via drill 1.02)
  other vias: 33.02,53.34
N$33  (via drill 1.02)
  other vias: 30.48,53.34
N$34  (via drill 1.02)
  other vias: 27.94,53.34
N$35  (via drill 1.02)
  other vias: 25.4,53.34
N$36  (via drill 1.02)
  other vias: 22.86,53.34
N$37  (via drill 1.02)
  other vias: 20.32,53.34
N$38  (via drill 1.02)
  other vias: 58.42,50.8
N$39  (via drill 1.02)
  other vias: 55.88,50.8
N$40  (via drill 1.02)
  other vias: 53.34,50.8
N$41  (via drill 1.02)
  other vias: 50.8,50.8
N$42  (via drill 1.02)
  other vias: 48.26,50.8
N$43  (via drill 1.02)
  other vias: 45.72,50.8
N$44  (via drill 1.02)
  other vias: 43.18,50.8
N$45  (via drill 1.02)
  other vias: 40.64,50.8
N$46  (via drill 1.02)
  other vias: 38.1,50.8
N$47  (via drill 1.02)
  other vias: 35.56,50.8
N$48  (via drill 1.02)
  other vias: 33.02,50.8
N$49  (via drill 1.02)
  other vias: 30.48,50.8
N$50  (via drill 1.02)
  other vias: 27.94,50.8
N$51  (via drill 1.02)
  other vias: 25.4,50.8
N$52  (via drill 1.02)
  other vias: 22.86,50.8
N$53  (via drill 1.02)
  other vias: 20.32,50.8
N$54  (via drill 1.02)
  other vias: 58.42,48.26
N$55  (via drill 1.02)
  other vias: 55.88,48.26
N$56  (via drill 1.02)
  other vias: 53.34,48.26
N$57  (via drill 1.02)
  other vias: 50.8,48.26
N$58  (via drill 1.02)
  other vias: 48.26,48.26
N$59  (via drill 1.02)
  other vias: 45.72,48.26
N$60  (via drill 1.02)
  other vias: 43.18,48.26
N$61  (via drill 1.02)
  other vias: 40.64,48.26
N$62  (via drill 1.02)
  other vias: 38.1,48.26
N$63  (via drill 1.02)
  other vias: 35.56,48.26
N$64  (via drill 1.02)
  other vias: 33.02,48.26
N$65  (via drill 1.02)
  other vias: 30.48,48.26
N$66  (via drill 1.02)
  other vias: 27.94,48.26
N$67  (via drill 1.02)
  other vias: 25.4,48.26
N$68  (via drill 1.02)
  other vias: 22.86,48.26
N$69  (via drill 1.02)
  other vias: 20.32,48.26
N$70  (via drill 1.02)
  other vias: 35.56,81.28
N$71  (via drill 1.02)
  other vias: 33.02,81.28
N$72  (via drill 1.02)
  other vias: 53.34,45.72
N$73  (via drill 1.02)
  other vias: 50.8,45.72
N$74  (via drill 1.02)
  other vias: 48.26,45.72
N$75  (via drill 1.02)
  other vias: 45.72,45.72
N$76  (via drill 1.02)
  other vias: 43.18,45.72
N$77  (via drill 1.02)
  other vias: 40.64,45.72
N$78  (via drill 1.02)
  other vias: 38.1,45.72
N$79  (via drill 1.02)
  other vias: 35.56,45.72
N$80  (via drill 1.02)
  other vias: 33.02,45.72
N$81  (via drill 1.02)
  other vias: 30.48,45.72
N$82  (via drill 1.02)
  other vias: 27.94,45.72
N$83  (via drill 1.02)
  other vias: 25.4,45.72
N$84  (via drill 1.02)
  other vias: 22.86,45.72
N$85  (via drill 1.02)
  other vias: 20.32,45.72
N$86  (via drill 1.02)
  other vias: 30.48,81.28
N$87  (via drill 1.02)
  other vias: 27.94,81.28
N$88  (via drill 1.02)
  other vias: 53.34,43.18
N$89  (via drill 1.02)
  other vias: 50.8,43.18
N$90  (via drill 1.02)
  other vias: 48.26,43.18
N$91  (via drill 1.02)
  other vias: 45.72,43.18
N$92  (via drill 1.02)
  other vias: 43.18,43.18
N$93  (via drill 1.02)
  other vias: 40.64,43.18
N$94  (via drill 1.02)
  other vias: 38.1,43.18
N$95  (via drill 1.02)
  other vias: 35.56,43.18
N$96  (via drill 1.02)
  other vias: 33.02,43.18
N$97  (via drill 1.02)
  other vias: 30.48,43.18
N$98  (via drill 1.02)
  other vias: 27.94,43.18
N$99  (via drill 1.02)
  other vias: 25.4,43.18
N$100  (via drill 1.02)
  other vias: 22.86,43.18
N$101  (via drill 1.02)
  other vias: 20.32,43.18
N$102  (via drill 1.02)
  other vias: 25.4,81.28
N$103  (via drill 1.02)
  other vias: 22.86,81.28
N$104  (via drill 1.02)
  other vias: 53.34,40.64
N$105  (via drill 1.02)
  other vias: 50.8,40.64
N$106  (via drill 1.02)
  other vias: 48.26,40.64
N$107  (via drill 1.02)
  other vias: 45.72,40.64
N$108  (via drill 1.02)
  other vias: 43.18,40.64
N$109  (via drill 1.02)
  other vias: 40.64,40.64
N$110  (via drill 1.02)
  other vias: 38.1,40.64
N$111  (via drill 1.02)
  other vias: 35.56,40.64
N$112  (via drill 1.02)
  other vias: 33.02,40.64
N$113  (via drill 1.02)
  other vias: 30.48,40.64
N$114  (via drill 1.02)
  other vias: 27.94,40.64
N$115  (via drill 1.02)
  other vias: 25.4,40.64
N$116  (via drill 1.02)
  other vias: 22.86,40.64
N$117  (via drill 1.02)
  other vias: 20.32,40.64
N$118  (via drill 1.02)
  other vias: 20.32,81.28
N$119  (via drill 1.02)
  other vias: 17.78,81.28
N$120  (via drill 1.02)
  other vias: 53.34,38.1
N$121  (via drill 1.02)
  other vias: 50.8,38.1
N$122  (via drill 1.02)
  other vias: 48.26,38.1
N$123  (via drill 1.02)
  other vias: 45.72,38.1
N$124  (via drill 1.02)
  other vias: 43.18,38.1
N$125  (via drill 1.02)
  other vias: 40.64,38.1
N$126  (via drill 1.02)
  other vias: 38.1,38.1
N$127  (via drill 1.02)
  other vias: 35.56,38.1
N$128  (via drill 1.02)
  other vias: 33.02,38.1
N$129  (via drill 1.02)
  other vias: 30.48,38.1
N$130  (via drill 1.02)
  other vias: 27.94,38.1
N$131  (via drill 1.02)
  other vias: 25.4,38.1
N$132  (via drill 1.02)
  other vias: 22.86,38.1
N$133  (via drill 1.02)
  other vias: 20.32,38.1
N$134  (via drill 1.02)
  other vias: 58.42,35.56
N$135  (via drill 1.02)
  other vias: 55.88,35.56
N$136  (via drill 1.02)
  other vias: 53.34,35.56
N$137  (via drill 1.02)
  other vias: 50.8,35.56
N$138  (via drill 1.02)
  other vias: 48.26,35.56
N$139  (via drill 1.02)
  other vias: 45.72,35.56
N$140  (via drill 1.02)
  other vias: 43.18,35.56
N$141  (via drill 1.02)
  other vias: 40.64,35.56
N$142  (via drill 1.02)
  other vias: 38.1,35.56
N$143  (via drill 1.02)
  other vias: 35.56,35.56
N$144  (via drill 1.02)
  other vias: 33.02,35.56
N$145  (via drill 1.02)
  other vias: 30.48,35.56
N$146  (via drill 1.02)
  other vias: 27.94,35.56
N$147  (via drill 1.02)
  other vias: 25.4,35.56
N$148  (via drill 1.02)
  other vias: 22.86,35.56
N$149  (via drill 1.02)
  other vias: 20.32,35.56
N$150  (via drill 1.02)
  other vias: 58.42,33.02
N$151  (via drill 1.02)
  other vias: 55.88,33.02
N$152  (via drill 1.02)
  other vias: 53.34,33.02
N$153  (via drill 1.02)
  other vias: 50.8,33.02
N$154  (via drill 1.02)
  other vias: 48.26,33.02
N$155  (via drill 1.02)
  other vias: 45.72,33.02
N$156  (via drill 1.02)
  other vias: 43.18,33.02
N$157  (via drill 1.02)
  other vias: 40.64,33.02
N$158  (via drill 1.02)
  other vias: 38.1,33.02
N$159  (via drill 1.02)
  other vias: 35.56,33.02
N$160  (via drill 1.02)
  other vias: 33.02,33.02
N$161  (via drill 1.02)
  other vias: 30.48,33.02
N$162  (via drill 1.02)
  other vias: 27.94,33.02
N$163  (via drill 1.02)
  other vias: 25.4,33.02
N$164  (via drill 1.02)
  other vias: 22.86,33.02
N$165  (via drill 1.02)
  other vias: 20.32,33.02
N$166  (via drill 1.02)
  other vias: 58.42,30.48
N$167  (via drill 1.02)
  other vias: 55.88,30.48
N$168  (via drill 1.02)
  other vias: 53.34,30.48
N$169  (via drill 1.02)
  other vias: 50.8,30.48
N$170  (via drill 1.02)
  other vias: 48.26,30.48
N$171  (via drill 1.02)
  other vias: 45.72,30.48
N$172  (via drill 1.02)
  other vias: 43.18,30.48
N$173  (via drill 1.02)
  other vias: 40.64,30.48
N$174  (via drill 1.02)
  other vias: 38.1,30.48
N$175  (via drill 1.02)
  other vias: 35.56,30.48
N$176  (via drill 1.02)
  other vias: 33.02,30.48
N$177  (via drill 1.02)
  other vias: 30.48,30.48
N$178  (via drill 1.02)
  other vias: 27.94,30.48
N$179  (via drill 1.02)
  other vias: 25.4,30.48
N$180  (via drill 1.02)
  other vias: 22.86,30.48
N$181  (via drill 1.02)
  other vias: 20.32,30.48
N$182  (via drill 1.02)
  other vias: 60.96,55.88
N$183  (via drill 1.02)
  other vias: 60.96,53.34
N$184  (via drill 1.02)
  other vias: 60.96,50.8
N$185  (via drill 1.02)
  other vias: 60.96,48.26
N$186  (via drill 1.02)
  other vias: 15.24,81.28
N$187  (via drill 1.02)
  other vias: 12.7,81.28
N$188  (via drill 1.02)
  other vias: 50.8,81.28
N$189  (via drill 1.02)
  other vias: 48.26,81.28
N$190  (via drill 1.02)
  other vias: 60.96,35.56
N$191  (via drill 1.02)
  other vias: 60.96,33.02
N$192  (via drill 1.02)
  other vias: 60.96,43.18
N$197  (via drill 1.02)
  other vias: 45.72,81.28
N$198  (via drill 1.02)
  other vias: 43.18,81.28
N$199  (via drill 1.02)
  other vias: 40.64,81.28
N$200  (via drill 1.02)
  other vias: 38.1,81.28
N$203  (via drill 1.02)
  other vias: 60.96,30.48
N$204  (via drill 1.02)
  other vias: 15.24,12.7
N$205  (via drill 1.02)
  other vias: 12.7,12.7
N$206  (via drill 1.02)
  other vias: 15.24,10.16
N$207  (via drill 1.02)
  other vias: 12.7,10.16
N$208  (via drill 1.02)
  other vias: 10.16,81.28
N$209  (via drill 1.02)
  other vias: 35.56,7.62
N$210  (via drill 1.02)
  other vias: 33.02,7.62
N$211  (via drill 1.02)
  other vias: 30.48,7.62
N$212  (via drill 1.02)
  other vias: 58.42,43.18
N$213  (via drill 1.02)
  other vias: 55.88,43.18
N$215  (via drill 1.02)
  other vias: 27.94,7.62
N$216  (via drill 1.02)
  other vias: 25.4,7.62
N$217  (via drill 1.02)
  other vias: 22.86,7.62
N$218  (via drill 1.02)
  other vias: 20.32,7.62
N$219  (via drill 1.02)
  other vias: 17.78,7.62
N$220  (via drill 1.02)
  other vias: 60.96,7.62
N$221  (via drill 1.02)
  other vias: 58.42,7.62
N$222  (via drill 1.02)
  other vias: 55.88,7.62
N$223  (via drill 1.02)
  other vias: 53.34,7.62
N$224  (via drill 1.02)
  other vias: 50.8,7.62
N$225  (via drill 1.02)
  other vias: 60.96,40.64
N$226  (via drill 1.02)
  other vias: 48.26,7.62
N$227  (via drill 1.02)
  other vias: 45.72,7.62
N$228  (via drill 1.02)
  other vias: 43.18,7.62
N$229  (via drill 1.02)
  other vias: 40.64,7.62
N$230  (via drill 1.02)
  other vias: 38.1,7.62
N$231  (via drill 1.02)
  other vias: 15.24,7.62
N$232  (via drill 1.02)
  other vias: 12.7,7.62
N$233  (via drill 1.02)
  other vias: 10.16,7.62
N$236  (via drill 1.02)
  other vias: 58.42,40.64
N$237  (via drill 1.02)
  other vias: 35.56,78.74
N$238  (via drill 1.02)
  other vias: 33.02,78.74
N$239  (via drill 1.02)
  other vias: 30.48,78.74
N$240  (via drill 1.02)
  other vias: 27.94,78.74
N$241  (via drill 1.02)
  other vias: 25.4,78.74
N$242  (via drill 1.02)
  other vias: 22.86,78.74
N$243  (via drill 1.02)
  other vias: 20.32,78.74
N$244  (via drill 1.02)
  other vias: 17.78,78.74
N$245  (via drill 1.02)
  other vias: 15.24,78.74
N$246  (via drill 1.02)
  other vias: 12.7,78.74
N$247  (via drill 1.02)
  other vias: 55.88,40.64
N$253  (via drill 1.02)
  other vias: 60.96,83.82
N$254  (via drill 1.02)
  other vias: 58.42,83.82
N$256  (via drill 1.02)
  other vias: 60.96,78.74
N$257  (via drill 1.02)
  other vias: 58.42,78.74
N$258  (via drill 1.02)
  other vias: 55.88,78.74
N$259  (via drill 1.02)
  other vias: 53.34,78.74
N$260  (via drill 1.02)
  other vias: 50.8,78.74
N$261  (via drill 1.02)
  other vias: 48.26,78.74
N$262  (via drill 1.02)
  other vias: 45.72,78.74
N$263  (via drill 1.02)
  other vias: 43.18,78.74
N$264  (via drill 1.02)
  other vias: 40.64,78.74
N$265  (via drill 1.02)
  other vias: 38.1,78.74
N$266  (via drill 1.02)
  other vias: 35.56,76.2
N$267  (via drill 1.02)
  other vias: 33.02,76.2
N$268  (via drill 1.02)
  other vias: 30.48,76.2
N$269  (via drill 1.02)
  other vias: 27.94,76.2
N$270  (via drill 1.02)
  other vias: 25.4,76.2
N$271  (via drill 1.02)
  other vias: 22.86,76.2
N$272  (via drill 1.02)
  other vias: 20.32,76.2
N$273  (via drill 1.02)
  other vias: 17.78,76.2
N$274  (via drill 1.02)
  other vias: 15.24,76.2
N$275  (via drill 1.02)
  other vias: 12.7,76.2
N$276  (via drill 1.02)
  other vias: 60.96,38.1
N$277  (via drill 1.02)
  other vias: 35.56,73.66
N$278  (via drill 1.02)
  other vias: 33.02,73.66
N$279  (via drill 1.02)
  other vias: 30.48,73.66
N$280  (via drill 1.02)
  other vias: 27.94,73.66
N$281  (via drill 1.02)
  other vias: 25.4,73.66
N$282  (via drill 1.02)
  other vias: 22.86,73.66
N$283  (via drill 1.02)
  other vias: 20.32,73.66
N$284  (via drill 1.02)
  other vias: 17.78,73.66
N$285  (via drill 1.02)
  other vias: 15.24,73.66
N$286  (via drill 1.02)
  other vias: 12.7,73.66
N$287  (via drill 1.02)
  other vias: 58.42,38.1
N$288  (via drill 1.02)
  other vias: 35.56,71.12
N$289  (via drill 1.02)
  other vias: 33.02,71.12
N$290  (via drill 1.02)
  other vias: 30.48,71.12
N$291  (via drill 1.02)
  other vias: 27.94,71.12
N$292  (via drill 1.02)
  other vias: 25.4,71.12
N$293  (via drill 1.02)
  other vias: 22.86,71.12
N$294  (via drill 1.02)
  other vias: 20.32,71.12
N$295  (via drill 1.02)
  other vias: 55.88,38.1
N$296  (via drill 1.02)
  other vias: 58.42,68.58
N$297  (via drill 1.02)
  other vias: 55.88,68.58
N$298  (via drill 1.02)
  other vias: 53.34,68.58
N$300  (via drill 1.02)
  other vias: 60.96,76.2
N$301  (via drill 1.02)
  other vias: 58.42,76.2
N$302  (via drill 1.02)
  other vias: 55.88,76.2
N$303  (via drill 1.02)
  other vias: 53.34,76.2
N$304  (via drill 1.02)
  other vias: 50.8,76.2
N$305  (via drill 1.02)
  other vias: 48.26,76.2
N$306  (via drill 1.02)
  other vias: 45.72,76.2
N$307  (via drill 1.02)
  other vias: 43.18,76.2
N$308  (via drill 1.02)
  other vias: 40.64,76.2
N$309  (via drill 1.02)
  other vias: 38.1,76.2
N$311  (via drill 1.02)
  other vias: 60.96,73.66
N$312  (via drill 1.02)
  other vias: 58.42,73.66
N$313  (via drill 1.02)
  other vias: 55.88,73.66
N$314  (via drill 1.02)
  other vias: 53.34,73.66
N$315  (via drill 1.02)
  other vias: 50.8,73.66
N$316  (via drill 1.02)
  other vias: 48.26,73.66
N$317  (via drill 1.02)
  other vias: 45.72,73.66
N$318  (via drill 1.02)
  other vias: 43.18,73.66
N$319  (via drill 1.02)
  other vias: 40.64,73.66
N$320  (via drill 1.02)
  other vias: 38.1,73.66
N$322  (via drill 1.02)
  other vias: 60.96,71.12
N$323  (via drill 1.02)
  other vias: 58.42,71.12
N$324  (via drill 1.02)
  other vias: 55.88,71.12
N$325  (via drill 1.02)
  other vias: 53.34,71.12
N$326  (via drill 1.02)
  other vias: 50.8,71.12
N$327  (via drill 1.02)
  other vias: 48.26,71.12
N$328  (via drill 1.02)
  other vias: 45.72,71.12
N$329  (via drill 1.02)
  other vias: 43.18,71.12
N$330  (via drill 1.02)
  other vias: 40.64,71.12
N$331  (via drill 1.02)
  other vias: 38.1,71.12
N$332  (via drill 1.02)
  other vias: 35.56,15.24
N$333  (via drill 1.02)
  other vias: 33.02,15.24
N$334  (via drill 1.02)
  other vias: 30.48,15.24
N$335  (via drill 1.02)
  other vias: 27.94,15.24
N$336  (via drill 1.02)
  other vias: 25.4,15.24
N$337  (via drill 1.02)
  other vias: 22.86,15.24
N$338  (via drill 1.02)
  other vias: 20.32,15.24
N$339  (via drill 1.02)
  other vias: 50.8,68.58
N$340  (via drill 1.02)
  other vias: 35.56,12.7
N$341  (via drill 1.02)
  other vias: 33.02,12.7
N$342  (via drill 1.02)
  other vias: 30.48,12.7
N$343  (via drill 1.02)
  other vias: 27.94,12.7
N$344  (via drill 1.02)
  other vias: 25.4,12.7
N$345  (via drill 1.02)
  other vias: 22.86,12.7
N$346  (via drill 1.02)
  other vias: 20.32,12.7
N$347  (via drill 1.02)
  other vias: 17.78,12.7
N$348  (via drill 1.02)
  other vias: 35.56,10.16
N$349  (via drill 1.02)
  other vias: 33.02,10.16
N$350  (via drill 1.02)
  other vias: 30.48,10.16
N$351  (via drill 1.02)
  other vias: 27.94,10.16
N$352  (via drill 1.02)
  other vias: 25.4,10.16
N$353  (via drill 1.02)
  other vias: 22.86,10.16
N$354  (via drill 1.02)
  other vias: 20.32,10.16
N$355  (via drill 1.02)
  other vias: 17.78,10.16
N$357  (via drill 1.02)
  other vias: 60.96,15.24
N$358  (via drill 1.02)
  other vias: 58.42,15.24
N$359  (via drill 1.02)
  other vias: 55.88,15.24
N$360  (via drill 1.02)
  other vias: 53.34,15.24
N$361  (via drill 1.02)
  other vias: 50.8,15.24
N$362  (via drill 1.02)
  other vias: 48.26,15.24
N$363  (via drill 1.02)
  other vias: 45.72,15.24
N$364  (via drill 1.02)
  other vias: 43.18,15.24
N$365  (via drill 1.02)
  other vias: 40.64,15.24
N$366  (via drill 1.02)
  other vias: 38.1,15.24
N$368  (via drill 1.02)
  other vias: 60.96,12.7
N$369  (via drill 1.02)
  other vias: 58.42,12.7
N$370  (via drill 1.02)
  other vias: 55.88,12.7
N$371  (via drill 1.02)
  other vias: 53.34,12.7
N$372  (via drill 1.02)
  other vias: 50.8,12.7
N$373  (via drill 1.02)
  other vias: 48.26,12.7
N$374  (via drill 1.02)
  other vias: 45.72,12.7
N$375  (via drill 1.02)
  other vias: 43.18,12.7
N$376  (via drill 1.02)
  other vias: 40.64,12.7
N$377  (via drill 1.02)
  other vias: 38.1,12.7
N$379  (via drill 1.02)
  other vias: 60.96,10.16
N$380  (via drill 1.02)
  other vias: 58.42,10.16
N$381  (via drill 1.02)
  other vias: 55.88,10.16
N$382  (via drill 1.02)
  other vias: 53.34,10.16
N$383  (via drill 1.02)
  other vias: 50.8,10.16
N$384  (via drill 1.02)
  other vias: 48.26,10.16
N$385  (via drill 1.02)
  other vias: 45.72,10.16
N$386  (via drill 1.02)
  other vias: 43.18,10.16
N$387  (via drill 1.02)
  other vias: 40.64,10.16
N$388  (via drill 1.02)
  other vias: 38.1,10.16
N$389  (via drill 1.02)
  other vias: 55.88,83.82
N$390  (via drill 1.02)
  other vias: 53.34,83.82
N$391  (via drill 1.02)
  other vias: 35.56,83.82
N$392  (via drill 1.02)
  other vias: 33.02,83.82
N$393  (via drill 1.02)
  other vias: 30.48,83.82
N$394  (via drill 1.02)
  other vias: 27.94,83.82
N$395  (via drill 1.02)
  other vias: 25.4,83.82
N$396  (via drill 1.02)
  other vias: 22.86,83.82
N$397  (via drill 1.02)
  other vias: 20.32,83.82
N$398  (via drill 1.02)
  other vias: 17.78,83.82
N$399  (via drill 1.02)
  other vias: 15.24,83.82
N$400  (via drill 1.02)
  other vias: 12.7,83.82
N$401  (via drill 1.02)
  other vias: 50.8,83.82
N$402  (via drill 1.02)
  other vias: 48.26,83.82
N$403  (via drill 1.02)
  other vias: 45.72,83.82
N$404  (via drill 1.02)
  other vias: 43.18,83.82
N$405  (via drill 1.02)
  other vias: 48.26,68.58
N$406  (via drill 1.02)
  other vias: 45.72,68.58
N$407  (via drill 1.02)
  other vias: 43.18,68.58
N$408  (via drill 1.02)
  other vias: 40.64,68.58
N$409  (via drill 1.02)
  other vias: 38.1,68.58
N$410  (via drill 1.02)
  other vias: 35.56,68.58
N$411  (via drill 1.02)
  other vias: 33.02,68.58
N$412  (via drill 1.02)
  other vias: 30.48,68.58
N$413  (via drill 1.02)
  other vias: 40.64,83.82
N$414  (via drill 1.02)
  other vias: 38.1,83.82
N$415  (via drill 1.02)
  other vias: 10.16,83.82
N$435  (via drill 1.02)
  other vias: 27.94,68.58
N$436  (via drill 1.02)
  other vias: 25.4,68.58
N$437  (via drill 1.02)
  other vias: 22.86,68.58
N$438  (via drill 1.02)
  other vias: 20.32,68.58
N$439  (via drill 1.02)
  other vias: 58.42,66.04
N$440  (via drill 1.02)
  other vias: 55.88,66.04
N$441  (via drill 1.02)
  other vias: 53.34,66.04
N$442  (via drill 1.02)
  other vias: 50.8,66.04
N$443  (via drill 1.02)
  other vias: 48.26,66.04
N$444  (via drill 1.02)
  other vias: 45.72,66.04
N$445  (via drill 1.02)
  other vias: 43.18,66.04
N$459  (via drill 1.02)
  other vias: 60.96,81.28
N$460  (via drill 1.02)
  other vias: 58.42,81.28
N$461  (via drill 1.02)
  other vias: 55.88,81.28
N$462  (via drill 1.02)
  other vias: 53.34,81.28
N$476  (via drill 1.02)
  other vias: 40.64,66.04
N$477  (via drill 1.02)
  other vias: 38.1,66.04
N$478  (via drill 1.02)
  other vias: 35.56,66.04
N$479  (via drill 1.02)
  other vias: 33.02,66.04
N$480  (via drill 1.02)
  other vias: 30.48,66.04
N$481  (via drill 1.02)
  other vias: 27.94,66.04
N$482  (via drill 1.02)
  other vias: 25.4,66.04
N$483  (via drill 1.02)
  other vias: 22.86,66.04
N$484  (via drill 1.02)
  other vias: 20.32,66.04
N$485  (via drill 1.02)
  other vias: 58.42,63.5
N$486  (via drill 1.02)
  other vias: 55.88,63.5
N$487  (via drill 1.02)
  other vias: 53.34,63.5
N$488  (via drill 1.02)
  other vias: 50.8,63.5
N$489  (via drill 1.02)
  other vias: 48.26,63.5
N$490  (via drill 1.02)
  other vias: 45.72,63.5
N$491  (via drill 1.02)
  other vias: 43.18,63.5
N$492  (via drill 1.02)
  other vias: 40.64,63.5
N$493  (via drill 1.02)
  other vias: 38.1,63.5
N$494  (via drill 1.02)
  other vias: 35.56,63.5
N$495  (via drill 1.02)
  other vias: 33.02,63.5
N$496  (via drill 1.02)
  other vias: 30.48,63.5
N$497  (via drill 1.02)
  other vias: 27.94,63.5
N$498  (via drill 1.02)
  other vias: 25.4,63.5
N$499  (via drill 1.02)
  other vias: 22.86,63.5
N$500  (via drill 1.02)
  other vias: 20.32,63.5
N$501  (via drill 1.02)
  other vias: 58.42,60.96
N$502  (via drill 1.02)
  other vias: 55.88,60.96
N$503  (via drill 1.02)
  other vias: 53.34,60.96
N$504  (via drill 1.02)
  other vias: 50.8,60.96
N$505  (via drill 1.02)
  other vias: 48.26,60.96
N$506  (via drill 1.02)
  other vias: 45.72,60.96
N$507  (via drill 1.02)
  other vias: 43.18,60.96
N$508  (via drill 1.02)
  other vias: 40.64,60.96
N$509  (via drill 1.02)
  other vias: 38.1,60.96
N$510  (via drill 1.02)
  other vias: 35.56,60.96
N$511  (via drill 1.02)
  other vias: 33.02,60.96
N$512  (via drill 1.02)
  other vias: 30.48,60.96
N$513  (via drill 1.02)
  other vias: 27.94,60.96
N$514  (via drill 1.02)
  other vias: 25.4,60.96
N$515  (via drill 1.02)
  other vias: 22.86,60.96
N$516  (via drill 1.02)
  other vias: 20.32,60.96
N$517  (via drill 1.02)
  other vias: 53.34,58.42
N$518  (via drill 1.02)
  other vias: 50.8,58.42
N$519  (via drill 1.02)
  other vias: 48.26,58.42
N$520  (via drill 1.02)
  other vias: 45.72,58.42
N$521  (via drill 1.02)
  other vias: 43.18,58.42
N$522  (via drill 1.02)
  other vias: 40.64,58.42
N$523  (via drill 1.02)
  other vias: 38.1,58.42
N$524  (via drill 1.02)
  other vias: 35.56,58.42
N$525  (via drill 1.02)
  other vias: 33.02,58.42
N$526  (via drill 1.02)
  other vias: 30.48,58.42
N$527  (via drill 1.02)
  other vias: 27.94,58.42
N$528  (via drill 1.02)
  other vias: 25.4,58.42
N$529  (via drill 1.02)
  other vias: 22.86,58.42
N$530  (via drill 1.02)
  other vias: 20.32,58.42
N$531  (via drill 1.02)
  other vias: 60.96,68.58
N$532  (via drill 1.02)
  other vias: 60.96,66.04
N$533  (via drill 1.02)
  other vias: 60.96,63.5
N$534  (via drill 1.02)
  other vias: 60.96,60.96
N$540  (via drill 1.02)
  other vias: 60.96,58.42
N$541  (via drill 1.02)
  other vias: 58.42,58.42
N$542  (via drill 1.02)
  other vias: 55.88,58.42
N$543  (via drill 1.02)
  other vias: 53.34,27.94
N$544  (via drill 1.02)
  other vias: 50.8,27.94
N$545  (via drill 1.02)
  other vias: 48.26,27.94
N$546  (via drill 1.02)
  other vias: 45.72,27.94
N$547  (via drill 1.02)
  other vias: 43.18,27.94
N$548  (via drill 1.02)
  other vias: 40.64,27.94
N$549  (via drill 1.02)
  other vias: 38.1,27.94
N$550  (via drill 1.02)
  other vias: 35.56,27.94
N$551  (via drill 1.02)
  other vias: 33.02,27.94
N$552  (via drill 1.02)
  other vias: 30.48,27.94
N$553  (via drill 1.02)
  other vias: 27.94,27.94
N$554  (via drill 1.02)
  other vias: 25.4,27.94
N$555  (via drill 1.02)
  other vias: 22.86,27.94
N$556  (via drill 1.02)
  other vias: 20.32,27.94
N$557  (via drill 1.02)
  other vias: 53.34,25.4
N$558  (via drill 1.02)
  other vias: 50.8,25.4
N$559  (via drill 1.02)
  other vias: 48.26,25.4
N$560  (via drill 1.02)
  other vias: 45.72,25.4
N$561  (via drill 1.02)
  other vias: 43.18,25.4
N$562  (via drill 1.02)
  other vias: 40.64,25.4
N$563  (via drill 1.02)
  other vias: 38.1,25.4
N$564  (via drill 1.02)
  other vias: 35.56,25.4
N$565  (via drill 1.02)
  other vias: 33.02,25.4
N$566  (via drill 1.02)
  other vias: 30.48,25.4
N$567  (via drill 1.02)
  other vias: 27.94,25.4
N$568  (via drill 1.02)
  other vias: 25.4,25.4
N$569  (via drill 1.02)
  other vias: 22.86,25.4
N$570  (via drill 1.02)
  other vias: 20.32,25.4
N$571  (via drill 1.02)
  other vias: 53.34,22.86
N$572  (via drill 1.02)
  other vias: 50.8,22.86
N$573  (via drill 1.02)
  other vias: 48.26,22.86
N$574  (via drill 1.02)
  other vias: 45.72,22.86
N$575  (via drill 1.02)
  other vias: 43.18,22.86
N$576  (via drill 1.02)
  other vias: 40.64,22.86
N$577  (via drill 1.02)
  other vias: 38.1,22.86
N$578  (via drill 1.02)
  other vias: 35.56,22.86
N$579  (via drill 1.02)
  other vias: 33.02,22.86
N$580  (via drill 1.02)
  other vias: 30.48,22.86
N$581  (via drill 1.02)
  other vias: 27.94,22.86
N$582  (via drill 1.02)
  other vias: 25.4,22.86
N$583  (via drill 1.02)
  other vias: 22.86,22.86
N$584  (via drill 1.02)
  other vias: 20.32,22.86
N$585  (via drill 1.02)
  other vias: 58.42,20.32
N$586  (via drill 1.02)
  other vias: 55.88,20.32
N$587  (via drill 1.02)
  other vias: 53.34,20.32
N$588  (via drill 1.02)
  other vias: 50.8,20.32
N$589  (via drill 1.02)
  other vias: 48.26,20.32
N$590  (via drill 1.02)
  other vias: 45.72,20.32
N$591  (via drill 1.02)
  other vias: 43.18,20.32
N$592  (via drill 1.02)
  other vias: 40.64,20.32
N$593  (via drill 1.02)
  other vias: 38.1,20.32
N$594  (via drill 1.02)
  other vias: 35.56,20.32
N$595  (via drill 1.02)
  other vias: 33.02,20.32
N$596  (via drill 1.02)
  other vias: 30.48,20.32
N$597  (via drill 1.02)
  other vias: 27.94,20.32
N$598  (via drill 1.02)
  other vias: 25.4,20.32
N$599  (via drill 1.02)
  other vias: 22.86,20.32
N$600  (via drill 1.02)
  other vias: 20.32,20.32
N$601  (via drill 1.02)
  other vias: 58.42,17.78
N$602  (via drill 1.02)
  other vias: 55.88,17.78
N$603  (via drill 1.02)
  other vias: 53.34,17.78
N$604  (via drill 1.02)
  other vias: 50.8,17.78
N$605  (via drill 1.02)
  other vias: 48.26,17.78
N$606  (via drill 1.02)
  other vias: 45.72,17.78
N$607  (via drill 1.02)
  other vias: 43.18,17.78
N$608  (via drill 1.02)
  other vias: 40.64,17.78
N$609  (via drill 1.02)
  other vias: 38.1,17.78
N$610  (via drill 1.02)
  other vias: 35.56,17.78
N$611  (via drill 1.02)
  other vias: 33.02,17.78
N$612  (via drill 1.02)
  other vias: 30.48,17.78
N$613  (via drill 1.02)
  other vias: 27.94,17.78
N$614  (via drill 1.02)
  other vias: 25.4,17.78
N$615  (via drill 1.02)
  other vias: 22.86,17.78
N$616  (via drill 1.02)
  other vias: 20.32,17.78
N$617  (via drill 1.02)
  other vias: 60.96,20.32
N$618  (via drill 1.02)
  other vias: 60.96,17.78
N$622  (via drill 1.02)
  other vias: 60.96,27.94
N$623  (via drill 1.02)
  other vias: 58.42,27.94
N$624  (via drill 1.02)
  other vias: 55.88,27.94
N$626  (via drill 1.02)
  other vias: 60.96,25.4
N$627  (via drill 1.02)
  other vias: 58.42,25.4
N$628  (via drill 1.02)
  other vias: 55.88,25.4
N$630  (via drill 1.02)
  other vias: 60.96,22.86
N$631  (via drill 1.02)
  other vias: 58.42,22.86
N$632  (via drill 1.02)
  other vias: 55.88,22.86
N$634  (via drill 1.02)
  other vias: 17.78,55.88
N$635  (via drill 1.02)
  other vias: 15.24,55.88
N$636  (via drill 1.02)
  other vias: 12.7,55.88
N$637  (via drill 1.02)
  other vias: 17.78,53.34
N$638  (via drill 1.02)
  other vias: 15.24,53.34
N$639  (via drill 1.02)
  other vias: 12.7,53.34
N$640  (via drill 1.02)
  other vias: 17.78,50.8
N$641  (via drill 1.02)
  other vias: 15.24,50.8
N$642  (via drill 1.02)
  other vias: 12.7,50.8
N$643  (via drill 1.02)
  other vias: 17.78,48.26
N$644  (via drill 1.02)
  other vias: 15.24,48.26
N$645  (via drill 1.02)
  other vias: 12.7,48.26
N$646  (via drill 1.02)
  other vias: 17.78,45.72
N$647  (via drill 1.02)
  other vias: 15.24,45.72
N$648  (via drill 1.02)
  other vias: 12.7,45.72
N$649  (via drill 1.02)
  other vias: 17.78,43.18
N$650  (via drill 1.02)
  other vias: 15.24,43.18
N$651  (via drill 1.02)
  other vias: 12.7,43.18
N$652  (via drill 1.02)
  other vias: 17.78,40.64
N$653  (via drill 1.02)
  other vias: 15.24,40.64
N$654  (via drill 1.02)
  other vias: 12.7,40.64
N$655  (via drill 1.02)
  other vias: 17.78,38.1
N$656  (via drill 1.02)
  other vias: 15.24,38.1
N$657  (via drill 1.02)
  other vias: 12.7,38.1
N$658  (via drill 1.02)
  other vias: 17.78,35.56
N$659  (via drill 1.02)
  other vias: 15.24,35.56
N$660  (via drill 1.02)
  other vias: 12.7,35.56
N$661  (via drill 1.02)
  other vias: 17.78,33.02
N$662  (via drill 1.02)
  other vias: 15.24,33.02
N$663  (via drill 1.02)
  other vias: 12.7,33.02
N$664  (via drill 1.02)
  other vias: 17.78,30.48
N$665  (via drill 1.02)
  other vias: 15.24,30.48
N$666  (via drill 1.02)
  other vias: 12.7,30.48
N$667  (via drill 1.02)
  other vias: 17.78,71.12
N$668  (via drill 1.02)
  other vias: 15.24,71.12
N$669  (via drill 1.02)
  other vias: 12.7,71.12
N$670  (via drill 1.02)
  other vias: 17.78,15.24
N$671  (via drill 1.02)
  other vias: 15.24,15.24
N$672  (via drill 1.02)
  other vias: 12.7,15.24
N$673  (via drill 1.02)
  other vias: 17.78,68.58
N$674  (via drill 1.02)
  other vias: 15.24,68.58
N$675  (via drill 1.02)
  other vias: 12.7,68.58
N$676  (via drill 1.02)
  other vias: 17.78,66.04
N$677  (via drill 1.02)
  other vias: 15.24,66.04
N$678  (via drill 1.02)
  other vias: 12.7,66.04
N$679  (via drill 1.02)
  other vias: 17.78,63.5
N$680  (via drill 1.02)
  other vias: 15.24,63.5
N$681  (via drill 1.02)
  other vias: 12.7,63.5
N$682  (via drill 1.02)
  other vias: 17.78,60.96
N$683  (via drill 1.02)
  other vias: 15.24,60.96
N$684  (via drill 1.02)
  other vias: 12.7,60.96
N$685  (via drill 1.02)
  other vias: 17.78,58.42
N$686  (via drill 1.02)
  other vias: 15.24,58.42
N$687  (via drill 1.02)
  other vias: 12.7,58.42
N$688  (via drill 1.02)
  other vias: 17.78,27.94
N$689  (via drill 1.02)
  other vias: 15.24,27.94
N$690  (via drill 1.02)
  other vias: 12.7,27.94
N$691  (via drill 1.02)
  other vias: 17.78,25.4
N$692  (via drill 1.02)
  other vias: 15.24,25.4
N$693  (via drill 1.02)
  other vias: 12.7,25.4
N$694  (via drill 1.02)
  other vias: 17.78,22.86
N$695  (via drill 1.02)
  other vias: 15.24,22.86
N$696  (via drill 1.02)
  other vias: 12.7,22.86
N$697  (via drill 1.02)
  other vias: 17.78,20.32
N$698  (via drill 1.02)
  other vias: 15.24,20.32
N$699  (via drill 1.02)
  other vias: 12.7,20.32
N$700  (via drill 1.02)
  other vias: 17.78,17.78
N$701  (via drill 1.02)
  other vias: 15.24,17.78
N$702  (via drill 1.02)
  other vias: 12.7,17.78
N$703  (via drill 1.02)
  other vias: 10.16,55.88
N$704  (via drill 1.02)
  other vias: 10.16,53.34
N$705  (via drill 1.02)
  other vias: 10.16,50.8
N$706  (via drill 1.02)
  other vias: 10.16,48.26
N$707  (via drill 1.02)
  other vias: 10.16,45.72
N$708  (via drill 1.02)
  other vias: 10.16,43.18
N$709  (via drill 1.02)
  other vias: 10.16,40.64
N$710  (via drill 1.02)
  other vias: 10.16,38.1
N$711  (via drill 1.02)
  other vias: 10.16,35.56
N$712  (via drill 1.02)
  other vias: 10.16,33.02
N$713  (via drill 1.02)
  other vias: 10.16,30.48
N$714  (via drill 1.02)
  other vias: 10.16,78.74
N$718  (via drill 1.02)
  other vias: 10.16,76.2
N$722  (via drill 1.02)
  other vias: 10.16,73.66
N$726  (via drill 1.02)
  other vias: 10.16,71.12
N$727  (via drill 1.02)
  other vias: 10.16,15.24
N$728  (via drill 1.02)
  other vias: 10.16,12.7
N$730  (via drill 1.02)
  other vias: 10.16,10.16
N$736  (via drill 1.02)
  other vias: 10.16,68.58
N$737  (via drill 1.02)
  other vias: 10.16,66.04
N$738  (via drill 1.02)
  other vias: 10.16,63.5
N$739  (via drill 1.02)
  other vias: 10.16,60.96
N$740  (via drill 1.02)
  other vias: 10.16,58.42
N$741  (via drill 1.02)
  other vias: 10.16,27.94
N$742  (via drill 1.02)
  other vias: 10.16,25.4
N$743  (via drill 1.02)
  other vias: 10.16,22.86
N$744  (via drill 1.02)
  other vias: 10.16,20.32
N$745  (via drill 1.02)
  other vias: 10.16,17.78
VCC_SYS
  Top 0.406: H2.28 H2.27 88.25,43.2 87,44.45 80.01,44.45 H2BREAKOUT.28 H2BREAKOUT.27 74.93,44.45 67.31,44.45 U$11.14
  Bottom 0.61: U$5.14 U$5.13 U$5.12 U$5.11 U$5.10 U$5.9 U$5.8 U$5.7 U$5.6 U$5.5 U$5.4 U$5.3 U$5.2 U$5.1 10.79,4.45 64.39,4.45 66.04,6.1 U$11.1 U$11.2 U$11.3 U$11.4 U$11.5 U$11.6 U$11.7 U$11.8 U$11.9 U$11.10 U$11.11 U$11.12 U$11.13 U$11.14

### Text on the board
tPlace: Freetronics ArduSat Prototyping Module | v2.0 | by Jon Oxer | www.ardusat.org | H1 | H2 | H1 | H2 | +5V_SYS | +5V_SYS | 5V | 3V3 | VCC_SYS (3.3V) | VCC_SYS (3.3V) | 51 | 51 | CubeSat Bus / Breakout | www.freetronics.com/aspm | freetronics
bPlace: H1 | H2 | 1 | 2 | 1 | 2 | +5V_SYS | +5V_SYS | VCC_SYS (3.3V) | VCC_SYS (3.3V) | 51 | 52 | 51 | 52 | ROHS | Released under the TAPR / Open Hardware License / www.tapr.org/OHL | Copyright 2012 Freetronics Pty Ltd / www.freetronics.com/aspm / SKU: ASPM